# EAGLE design TGO (EAGLE 9.1.3)
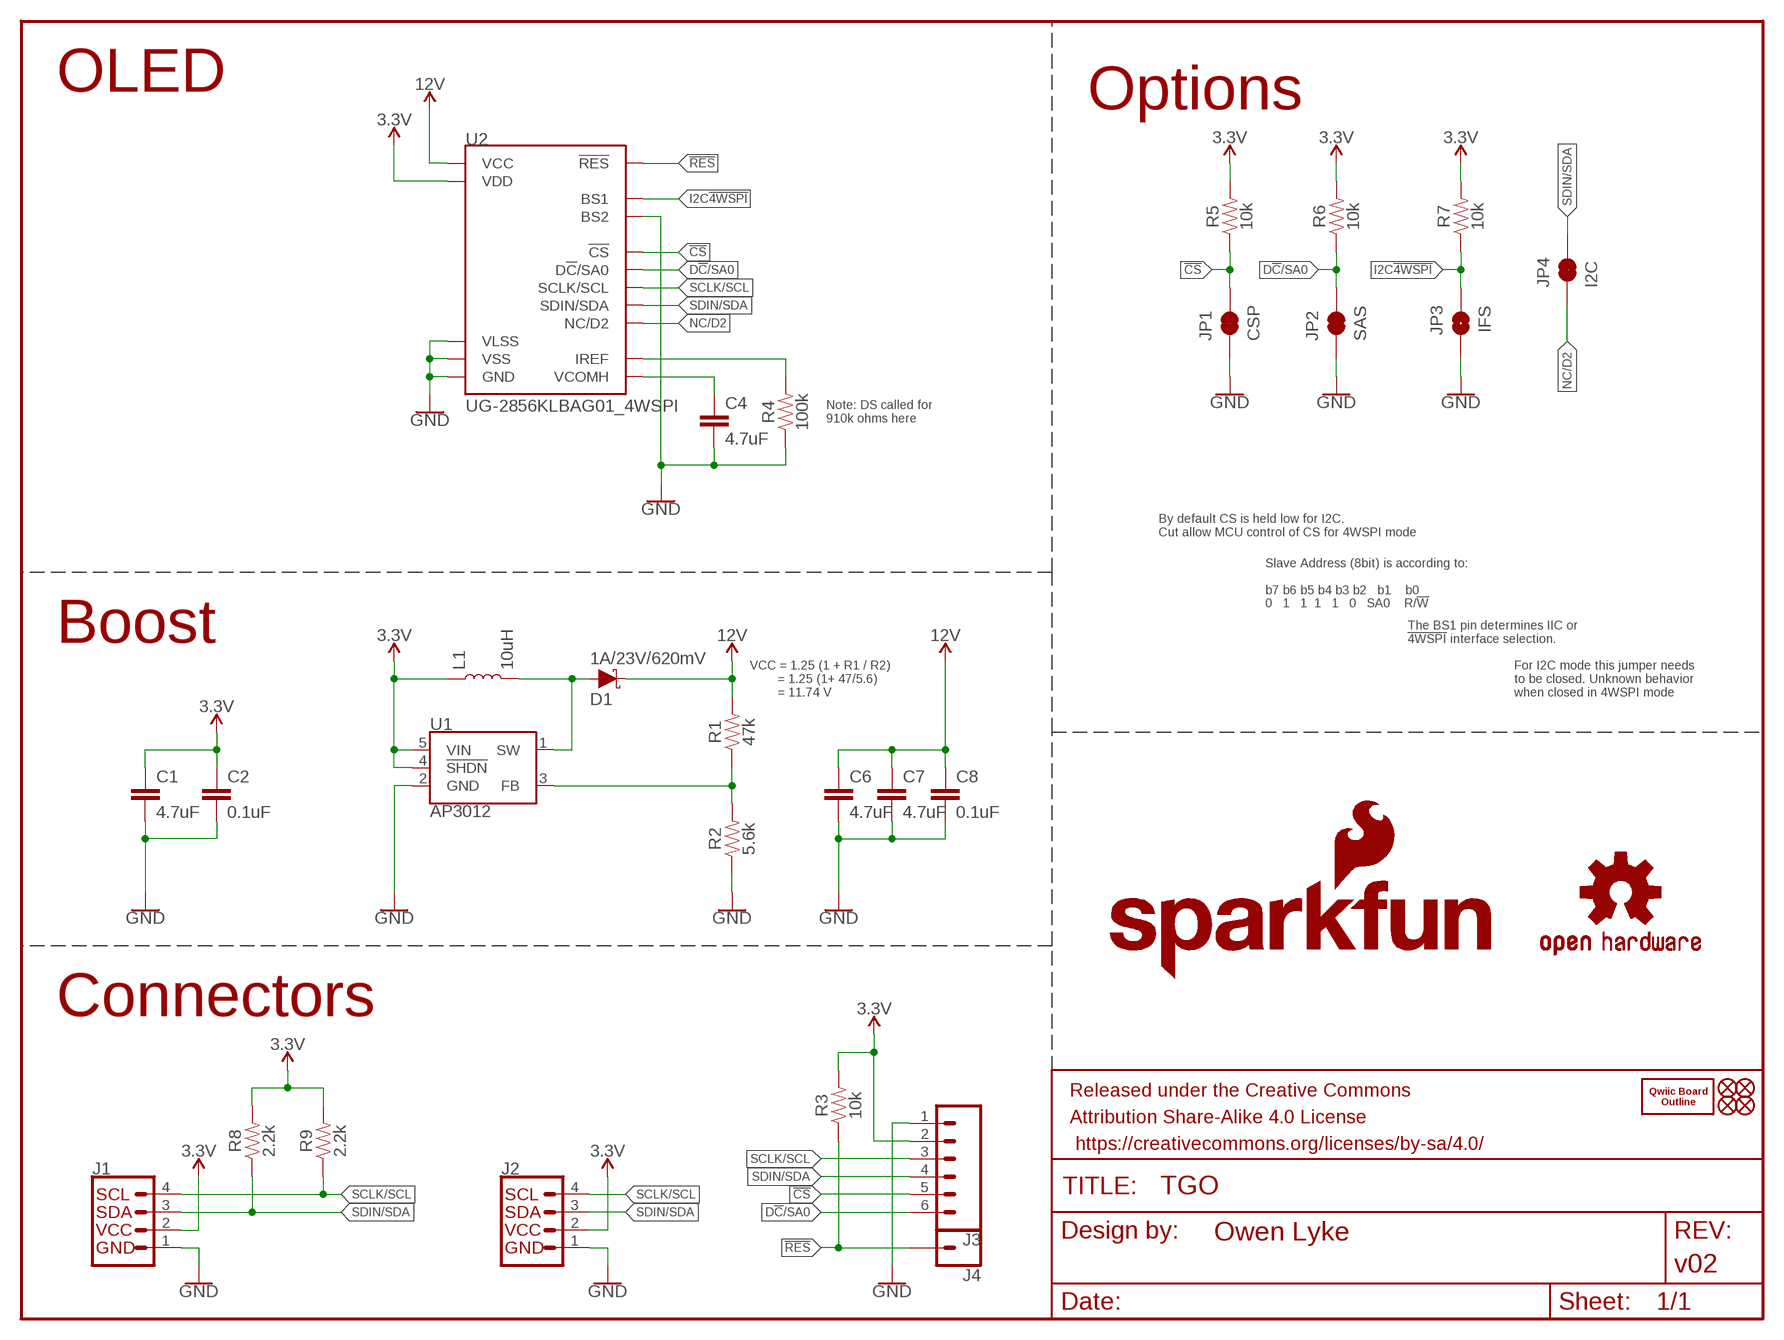
[diagram p0: schematic, sheet 1]

## Parts
C1  4.7uF  4.7UF-0603-35V-(20%)  [0603]
C2  0.1uF  0.1UF-0603-100V-10%  [0603]
C4  4.7uF  4.7UF-0603-35V-(20%)  [0603]
C6  4.7uF  4.7UF-0603-35V-(20%)  [0603]
C7  4.7uF  4.7UF-0603-35V-(20%)  [0603]
C8  0.1uF  0.1UF-0603-100V-10%  [0603]
D1  1A/23V/620mV  DIODE-SCHOTTKY-BAT20J  [SOD-323]
FD1  FIDUCIAL1X2  [FIDUCIAL-1X2]
FD2  FIDUCIAL1X2  [FIDUCIAL-1X2]
FD3  FIDUCIAL1X2  [FIDUCIAL-1X2]
FD4  FIDUCIAL1X2  [FIDUCIAL-1X2]
FRAME1  FRAME-LETTER  [CREATIVE_COMMONS]
J1  QWIIC_CONNECTORJS-1MM  [1X04_1MM_RA]
J2  QWIIC_CONNECTORJS-1MM  [1X04_1MM_RA]
J3  CONN_06NO_SILK_NO_POP  [1X06_NO_SILK]
J4  CONN_01PTH_NO_SILK_YES_STOP  [1X01_NO_SILK]
JP1  CSP  JUMPER-SMT_2_NC_TRACE_SILK  [SMT-JUMPER_2_NC_TRACE_SILK]
JP2  SAS  JUMPER-SMT_2_NC_TRACE_SILK  [SMT-JUMPER_2_NC_TRACE_SILK]
JP3  IFS  JUMPER-SMT_2_NO_SILK  [SMT-JUMPER_2_NO_SILK]
JP4  I2C  JUMPER-SMT_2_NC_TRACE_SILK  [SMT-JUMPER_2_NC_TRACE_SILK]
L1  10uH  INDUCTOR-CDRH-10UH  [INDUCTOR_4.7UH]
LOGO1  SFE_LOGO_NAME_FLAME.1_INCH  [SFE_LOGO_NAME_FLAME_.1]
LOGO2  OSHW-LOGOS  [OSHW-LOGO-S]
R1  47k  47KOHM-0603-1/10W-1%  [0603]
R2  5.6k  5.6KOHM-0603-1/10W-1%  [0603]
R3  10k  10KOHM-0603-1/10W-1%  [0603]
R4  100k  100KOHM-0603-1/10W-1%  [0603]
R5  10k  10KOHM-0603-1/10W-1%  [0603]
R6  10k  10KOHM-0603-1/10W-1%  [0603]
R7  10k  10KOHM-0603-1/10W-1%  [0603]
R8  2.2k  2.2KOHM-0603-1/10W-1%  [0603]
R9  2.2k  2.2KOHM-0603-1/10W-1%  [0603]
U1  AP3012  [SOT23-5]
U2  UG-2856KLBAG01_4WSPI  [FPC05024-42201]
U$1  QWIIC_BOARD_OUTLINEH  [QWIIC_BOARD_MOUNT_HOLES]

## Nets
3.3V: C1.1 C2.1 J1.2 J2.2 J3.2 L1.P$1 R3.2 R5.2 R6.2 R7.2 R8.2 R9.2 U1.4(!SHDN!) U1.5(VIN) U2.P$5(VDD)
12V: C6.1 C7.1 C8.1 D1.C R1.2 U2.P$23(VCC)
!CS: J3.5 JP1.2 R5.1 U2.P$8(!CS)
!RES: J4.1 R3.1 U2.P$9(!RES)
D!C!/SA0: J3.6 JP2.2 R6.1 U2.P$10(D!C!/SA0)
GND: C1.2 C2.2 C4.2 C6.2 C7.2 C8.2 J1.1 J2.1 J3.1 JP1.1 JP2.1 JP3.2 R2.1 R4.1 U1.2(GND) U2.P$1(GND) U2.P$2(VLSS) U2.P$3(VSS) U2.P$7(BS2) U2.P$11(GND) U2.P$12(GND) U2.P$16(GND) U2.P$17(GND) U2.P$18(GND) U2.P$19(GND) U2.P$20(GND) U2.P$24(GND)
I2C!4WSPI: JP3.1 R7.1 U2.P$6(BS1)
N$1: R4.2 U2.P$21(IREF)
N$3: C4.1 U2.P$22(VCOMH)
N$4: D1.A L1.P$2 U1.1(SW)
N$5: R1.1 R2.2 U1.3(FB)
NC/D2: JP4.1 U2.P$15(NC/D2)
SCLK/SCL: J1.4 J2.4 J3.3 R9.1 U2.P$13(SCLK/SCL)
SDIN/SDA: J1.3 J2.3 J3.4 JP4.2 R8.1 U2.P$14(SDIN/SDA)

## Notes on the sheet
- OLED | Options
- Note: DS called for
  910k ohms here
- By default CS is held low for I2C. 
  Cut allow MCU control of CS for 4WSPI mode
- Slave Address (8bit) is according to:
  
  b7 b6 b5 b4 b3 b2   b1    b0
  0   1   1  1   1   0   SA0    R/!W
- Boost
- The BS1 pin determines IIC or 
  !4WSPI! interface selection.
- VCC = 1.25 (1 + R1 / R2)
          = 1.25 (1+ 47/5.6)
          = 11.74 V
- For I2C mode this jumper needs 
  to be closed. Unknown behavior 
  when closed in 4WSPI mode
- Connectors

## Library data of the parts
C1 C4 C6 C7 = SparkFun-Capacitors:4.7UF: 4.7µF ceramic capacitors A capacitor is a passive two-terminal electrical component used to store electrical energy temporarily in an electric field.; PROD_ID: CAP-14106
C2 C8 = SparkFun-Capacitors:0.1UF: 0.1µF ceramic capacitors A capacitor is a passive two-terminal electrical component used to store electrical energy temporarily in an electric field.; PROD_ID: CAP-08390
D1 = SparkFun-DiscreteSemi:DIODE-SCHOTTKY: Schottky diode A Schottky diode is a semiconductor diode which has a low forward voltage drop and a very fast switching action.; PROD_ID: DIO-11623
FD1-FD4 = SparkFun-Aesthetics:FIDUCIAL: Fiducial Alignment Points Point-of-reference for pick-and-place machines and other optical instruments.
FRAME1 = SparkFun-Aesthetics:FRAME-LETTER: Schematic Frame - Letter Standard 8.5x11 US Letter frame; DESIGNER: Owen Lyke; REV: v02
J1 J2 = SparkFun-Connectors:QWIIC_CONNECTOR: SparkFun I2C Standard Qwiic Connector An SMD 1mm pitch JST connector makes it easy and quick (get it? Qwiic?) to connect I2C devices to each other. The Qwiic system <http://www.sparkfun.com/qwiic> enables fast and solderless connection between popular platforms and various sensors and actuators. We carry 200mm <https://www.sparkfun.com/products/14204>, 100mm <https://www.sparkfun.com/products/14205>, 50mm <https://www.sparkfun.com/products/14206>, and breadboard friendly <https://www.sparkfun.com/products/14207> Qwiic cables. We also offer 10 pcs strips <https://www.sparkfun.com/products/14323> the SMD connectors.; PROD_ID: CONN-13694
J3 = SparkFun-Connectors:CONN_06: Multi connection point. Often used as Generic Header-pin footprint for 0.1 inch spaced/style header connections On any of the 0.1 inch spaced packages, you can populate with these: Break Away Headers - Straight <https://www.sparkfun.com/products/116> (PRT-00116) Break Away Male Headers - Right Angle <https://www.sparkfun.com/products/553> (PRT-00553) Female Headers <https://www.sparkfun.com/products/115> (PRT-00115) Break Away Headers - Machine Pin <https://www.sparkfun.com/products/117> (PRT-00117) Break Away Female Headers - Swiss Machine Pin <https://www.sparkfun.com/products/743> (PRT-00743) Arduino Stackable Header - 6 Pin <https://www.sparkfun.com/products/9280> (PRT-09280) For SCREWTERMINALS and SPRING TERMINALS visit here: Screw Terimnals on SparkFun.com <https://www.sparkfun.com/search/results?term=Screw+Terminals> (5mm/3.5mm/2.54mm spacing) This device is also useful as a general connection point to wire up your design to another part of your project. Our various solder wires solder well into these plated through hole pads. Hook-Up Wire - Assortment (Stranded, 22 AWG) <https://www.sparkfun.com/products/11375> (PRT-11375) Hook-Up Wire - Assortment (Solid Core, 22 AWG) <https://www.sparkfun.com/products/11367> (PRT-11367) View the entire wire category on our website here <https://www.sparkfun.com/categories/141>
J4 = SparkFun-Connectors:CONN_01: Single connection point. Often used as Generic Header-pin footprint for 0.1 inch spaced/style header connections On any of the 0.1 inch spaced packages, you can populate with these: Break Away Headers - Straight <https://www.sparkfun.com/products/116> (PRT-00116) Break Away Male Headers - Right Angle <https://www.sparkfun.com/products/553> (PRT-00553) Female Headers <https://www.sparkfun.com/products/115> (PRT-00115) Break Away Headers - Machine Pin <https://www.sparkfun.com/products/117> (PRT-00117) Break Away Female Headers - Swiss Machine Pin <https://www.sparkfun.com/products/743> (PRT-00743) This device is also useful as a general connection point to wire up your design to another part of your project. Our various solder wires solder well into these plated through hole pads. Hook-Up Wire - Assortment (Stranded, 22 AWG) <https://www.sparkfun.com/products/11375> (PRT-11375) Hook-Up Wire - Assortment (Solid Core, 22 AWG) <https://www.sparkfun.com/products/11367> (PRT-11367) View the entire wire category on our website here <https://www.sparkfun.com/categories/141> Special notes: SMTSO-256-ET is a "flush mount" nut for a 4-40 screw. We mostly use this on specialty testbeds; it is a nice way to connect hardware to your PCB at an adjustable hieght. Also note, the SNAP packages are for using a snappable style connector. We sell a baggie of snaps and they are also used on two LilyPad designs: Snap Assortment - 30 pack (male and female) <https://www.sparkfun.com/products/11347> (DEV-11347) LilyPad Arduino SimpleSnap <https://www.sparkfun.com/products/10941> (DEV-10941) LilyPad SimpleSnap Protoboard <https://www.sparkfun.com/products/10940> (DEV-10940)
JP1 JP2 JP4 = SparkFun-Jumpers:JUMPER-SMT_2_NC_TRACE: Normally closed trace jumper This jumper has a trace between two pads so it's normally closed (NC). Use a razor knife to open the connection. For best results follow the IPC guidelines for cutting traces: Cutout at least 0.063 mm (0.005 in). Remove all loose material to clean up the cut area. Seal the cut with an approved epoxy. Reapply solder to reclose the connection.
JP3 = SparkFun-Jumpers:JUMPER-SMT_2_NO: Normally open jumper This jumper has two pads in close proximity to each other. Apply solder to close the connection. Round pads are easier to solder for beginners, but are a lot larger. SparkFun Product that uses the round pads: SparkFun EL Sequencer <https://www.sparkfun.com/products/12781>
L1 = SparkFun-Coils:INDUCTOR: Inductors Resist changes in electrical current. Basically a coil of wire. SparkFun Products: SparkFun Load Cell Amplifier - HX711 <https://www.sparkfun.com/products/13879> IOIO-OTG - V2.2 <https://www.sparkfun.com/products/13613>; PROD_ID: NDUC-13968
LOGO1 = SparkFun-Aesthetics:SFE_LOGO_NAME_FLAME: SparkFun Font Logo w/ Flame This is the SparkFun full logo. The logo on the schematic will always be the same size; the package variant is the height of the flame part of the logo. Default layer for the logo on the board is tSilk.
LOGO2 = SparkFun-Aesthetics:OSHW-LOGO: Open-Source Hardware (OSHW) Logo This logo indicates the piece of hardware it is found on incorporates a OSHW license and/or adheres to the definition of open source hardware found here: http://freedomdefined.org/OSHW
R1 = SparkFun-Resistors:47KOHM: 47kΩ resistor A resistor is a passive two-terminal electrical component that implements electrical resistance as a circuit element. Resistors act to reduce current flow, and, at the same time, act to lower voltage levels within circuits. - Wikipedia; PROD_ID: RES-07871
R2 = SparkFun-Resistors:5.6KOHM: 5.6kΩ resistor A resistor is a passive two-terminal electrical component that implements electrical resistance as a circuit element. Resistors act to reduce current flow, and, at the same time, act to lower voltage levels within circuits. - Wikipedia; PROD_ID: RES-12378
R3 R5-R7 = SparkFun-Resistors:10KOHM: 10kΩ resistor A resistor is a passive two-terminal electrical component that implements electrical resistance as a circuit element. Resistors act to reduce current flow, and, at the same time, act to lower voltage levels within circuits. - Wikipedia; PROD_ID: RES-00824
R4 = SparkFun-Resistors:100KOHM: 100kΩ resistor A resistor is a passive two-terminal electrical component that implements electrical resistance as a circuit element. Resistors act to reduce current flow, and, at the same time, act to lower voltage levels within circuits. - Wikipedia; PROD_ID: RES-07828
R8 R9 = SparkFun-Resistors:2.2KOHM: 2.2kΩ resistor A resistor is a passive two-terminal electrical component that implements electrical resistance as a circuit element. Resistors act to reduce current flow, and, at the same time, act to lower voltage levels within circuits. - Wikipedia; PROD_ID: RES-08272
U1 = SparkFun-IC-Power:AP3012: AP3012 The AP3012 is a high power, constant frequency, current mode PWM, inductor based, step-up (boost) converter. The converter operates at high frequency (1.5MHz) so that a small, low profile inductor can be used. Datasheet <https://www.diodes.com/assets/Datasheets/AP3012.pdf>; PROD_ID: VREG-13911
U2 = SparkFun-Displays:UG-2856KLBAG01_4WSPI; PROD_ID: CONN-14195
U$1 = SparkX:QWIIC_BOARD_OUTLINE: Standard Outline of a Qwiic Board. Good for defining a spot on shields and board areas in which to mount a Qwiic Board.

## Board
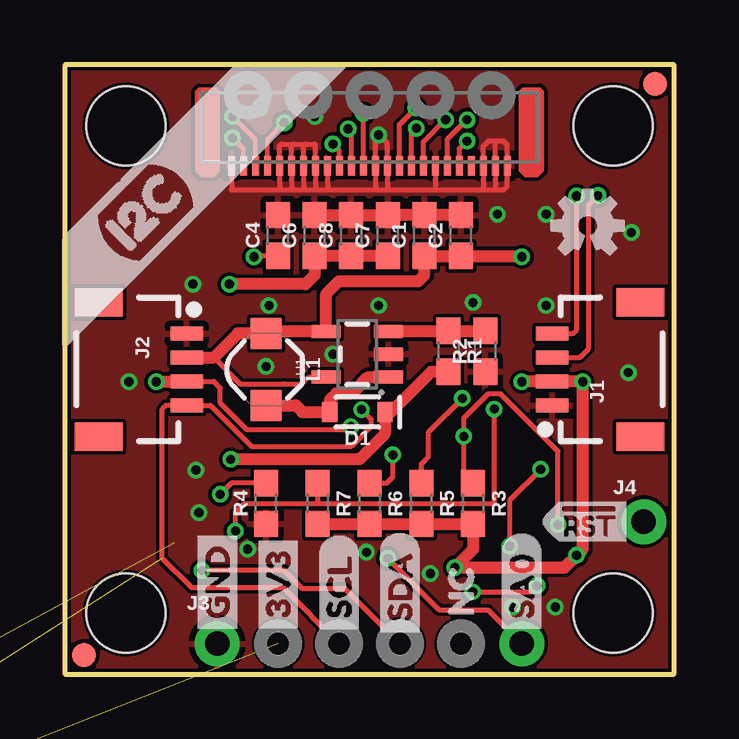
[diagram p1: board, top side]
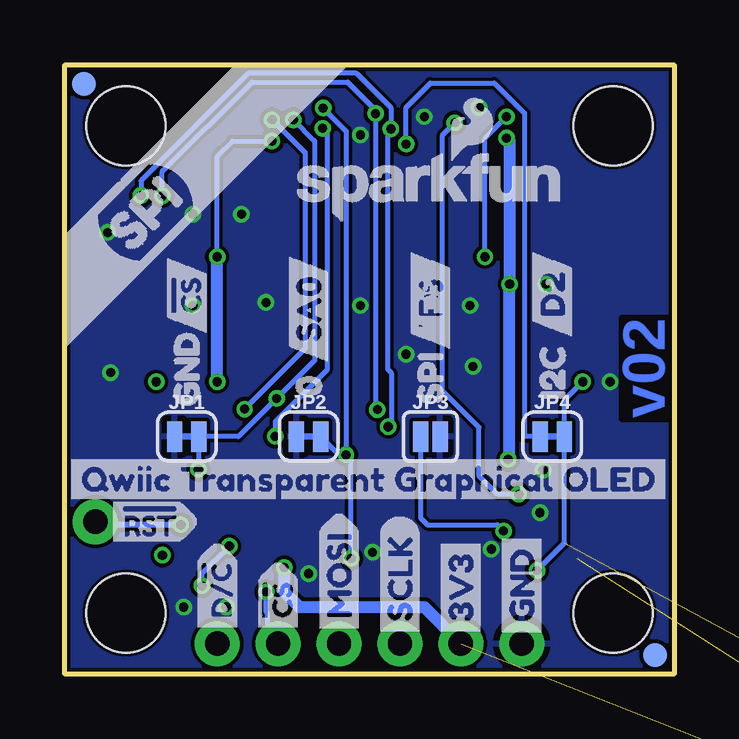
[diagram p2: board, bottom side, seen from below]

Size 25.4 x 25.4 mm. Coordinates in mm from the lower left corner, seen from the top.
Outline: 0,0 25.4,0 25.4,25.4 0,25.4 0,0
Copper layers (1*16): Top 0.035mm / dielectric 1.5mm / Bottom 0.035mm
Design rules "SparkFun-2-layer-PCBWay-LIMIT": minimum track width 6mil, minimum drill 0.3mm, track to track 6mil, track to pad 6mil, pad to pad 6mil, via to via 6mil, smd to smd 6mil, copper to edge 6mil, drill to drill 6mil, minimum pad ring 6mil, minimum via ring 6mil, stop-mask expansion 4mil, vias tented up to drill 25mil, thermal gap 10mil

### Footprints (pad centres in the part's own frame; a part is rotated, then mirrored left to right if it is on the bottom)
0603 = smd 1.1 x 1: 1 -0.85,0; 2 0.85,0
SOD-323 = smd 0.63 x 0.83: A 1.15,0; C -1.15,0
FIDUCIAL-1X2 = smd 1 x 1: 1 0,0
1X04_1MM_RA = smd 0.6 x 1.35: 1 -1.5,0; 2 -0.5,0; 3 0.5,0; 4 1.5,0 | smd 1.2 x 2: NC1 2.8,-3.675; NC2 -2.8,-3.675
1X06_NO_SILK = drill 1.016 pad 1.88: 1 0,0; 2 2.54,0; 3 5.08,0; 4 7.62,0; 5 10.16,0; 6 12.7,0
1X01_NO_SILK = drill 1.016 pad 1.88: 1 0,0
SMT-JUMPER_2_NC_TRACE_SILK = smd 0.635 x 1.27: 1 -0.508,0; 2 0.508,0
SMT-JUMPER_2_NO_SILK = smd 0.635 x 1.27: 1 -0.406,0; 2 0.406,0
INDUCTOR_4.7UH = smd 1.3 x 1.3: P$1 -1.5,0; P$2 1.5,0
SOT23-5 = smd 0.55 x 1.2: 1 -0.95,-1.3; 2 0,-1.3; 3 0.95,-1.3; 4 0.95,1.3; 5 -0.95,1.3
FPC05024-42201 = smd 0.3 x 0.8: P$1 -5.75,0.4; P$2 -5.25,0.4; P$3 -4.75,0.4; P$4 -4.25,0.4; P$5 -3.75,0.4; P$6 -3.25,0.4; P$7 -2.75,0.4; P$8 -2.25,0.4; P$9 -1.75,0.4; P$10 -1.25,0.4; P$11 -0.75,0.4; P$12 -0.25,0.4; P$13 0.25,0.4; P$14 0.75,0.4; P$15 1.25,0.4; P$16 1.75,0.4; P$17 2.25,0.4; P$18 2.75,0.4; P$19 3.25,0.4; P$20 3.75,0.4; P$21 4.25,0.4; P$22 4.75,0.4; P$23 5.25,0.4; P$24 5.75,0.4
QWIIC_BOARD_MOUNT_HOLES = hole 3.302: -10.16,10.16; 10.16,10.16; 10.16,-10.16; -10.16,-10.16

### Placement (x,y rotation side)
C1  14.99,18.29 90 top
C2  16.51,18.29 90 top
C4  8.89,18.29 90 top
C6  10.41,18.29 90 top
C7  13.46,18.29 90 top
C8  11.94,18.29 90 top
D1  12.19,10.92 180 top
FD1  0.79,0.79 0 top
FD2  0.79,0.79 0 bottom
FD3  24.61,24.61 0 top
FD4  24.61,24.61 0 bottom
FRAME1  -11.43,-10.16 0 top  (outside the outline)
J1  20.32,12.7 90 top
J2  5.08,12.7 270 top
J3  6.35,1.27 0 top
J4  24.13,6.35 0 top
JP1  20.32,9.91 0 bottom
JP2  15.24,9.91 0 bottom
JP3  10.16,9.91 0 bottom
JP4  5.08,9.91 0 bottom
L1  8.38,12.7 270 top
LOGO1  10.16,20.32 0 bottom
LOGO2  21.79,18.69 0 top
R1  16,13.46 270 top
R2  17.53,13.46 90 top
R3  17.02,7.11 270 top
R4  8.38,7.11 90 top
R5  14.86,7.11 270 top
R6  12.7,7.11 270 top
R7  10.54,7.11 270 top
R8  -30.48,-13.97 0 top  (outside the outline)
R9  -30.48,-17.78 0 top  (outside the outline)
U1  12.19,13.34 90 top
U2  12.7,21.59 180 top
U$1  12.7,12.7 0 top
U$2  [QWIIC_TRANSPARENT_GRAPHICAL_OLED15]  25.65,8.13 0 bottom
U$3  [D27]  5.08,13.97 90 bottom
U$4  [GND0]  6.35,1.4 90 top
U$5  [3V31]  8.89,1.4 90 top
U$6  [SCL2]  11.43,1.4 90 top
U$7  [SDA3]  13.97,1.27 90 top
U$8  [#CS7]  16.51,1.27 90 bottom
U$9  [NC10]  16.51,1.52 90 top
U$10  [MOSI9]  13.97,1.4 90 bottom
U$11  [SCLK8]  11.43,1.27 90 bottom
U$12  [SA08]  19.05,1.4 90 top
U$13  [3V31]  8.89,1.27 90 bottom
U$14  [GND0]  6.35,1.27 90 bottom
U$15  [D##C6]  19.05,1.27 90 bottom
U$16  [GND10]  20.32,10.29 90 bottom
U$17  [#RST1]  24.03,6.35 0 bottom
U$18  [013]  15.24,10.67 90 bottom
U$19  [I2C3]  1.14,17.14 45 top
U$20  [D27]  10.16,13.97 90 bottom
U$21  [SA05]  15.24,12.95 90 bottom
U$22  [I2C13]  5.08,10.54 90 bottom
U$23  [#CS4]  20.32,13.97 90 bottom
U$24  [SPI2]  24.13,17.14 45 bottom
U$26  [IFS17]  10.16,13.46 90 bottom
U$28  [#RST0]  19.68,6.35 0 top
U$29  [SPI6]  10.16,10.41 90 bottom

### Tracks (layer width: path | path; a pad name or v marks a point on that pad's centre or on a via)
3.3V  (via drill 0.38)  (2 unrouted)
  Top 0.203: U2.P$5 16.45,21.91 v16.76,22.23 | U1.5 10.16,12.38 9.88,12.1 9.14,12.1 7.31,12.1 6.21,13.2
  Top 0.508: J2.2 6.21,13.2 7.21,14.2 L1.P$1 8.47,14.29 U1.4 10.89,15.85 11.43,16.38 14.73,16.38 14.99,16.64 C1.1 C2.1 19.01,17.44 v19.05,17.4 | v19.05,12.19 v19.06,12.2 J1.2 v21.58,12.2 v21.59,12.19 21.59,5.21 v21.34,4.95 20.83,4.45 v16.26,4.45 17.02,5.21 R3.2 R5.2 R6.2 R7.2
  Bottom 0.203: v19.05,17.4 19.05,21.59 18.41,22.23 v16.76,22.23
  Bottom 0.508: v19.05,12.19 v19.05,17.4 | v16.26,4.45 16.26,3.43 15.62,2.79 10.41,2.79 J3.2
12V  (via drill 0.38)
  Top 0.203: U2.P$23 7.45,21.89 v6.99,22.35
  Top 0.508: C7.1 C8.1 C6.1 10.41,16.64 10.03,16.26 v6.86,16.26 | R1.2 15.28,12.61 13.59,10.92 D1.C 13.34,10.02 12.27,8.95 v6.92,8.95
  Bottom 0.508: v6.99,22.35 6.86,22.23 v6.86,16.26 6.86,9.01 v6.92,8.95
!CS  (via drill 0.38)
  Top 0.203: U2.P$8 14.95,22.19 v15.88,23.11 | R5.1 14.86,8.76 15.05,8.95 15.15,9.05 15.15,10.07 v16.57,11.49 | v17,3.43 19.43,3.43 v19.68,3.68 | v19.84,8.53 18.54,7.24 v18.54,5.33
  Bottom 0.203: v15.88,23.11 14.99,22.23 14.99,13.08 v16.57,11.49 18.16,9.91 JP1.2 19.81,8.56 v19.84,8.53 | J3.5 16.95,1.71 16.95,2.54 17,2.59 v17,3.43 | v19.68,3.68 19.68,4.19 v18.54,5.33
!RES  (via drill 0.38)
  Top 0.203: U2.P$9 14.45,22.55 v14.66,22.76 | R3.1 16.63,8.35 v16.63,9.91 16.63,10.67 17.64,11.68 18.16,11.68 20.56,9.28 v20.56,6.22
  Bottom 0.203: v14.66,22.76 14.48,22.58 14.48,12.68 16.63,10.52 v16.63,9.91
  Bottom 0.254: v20.56,6.22 24,6.22 J4.1
D!C!/SA0  (via drill 0.38)
  Top 0.203: U2.P$10 13.95,22.92 v14.63,23.6 | J3.6 17.65,2.67 15.62,2.67 v13.46,4.83 | R6.1 13.42,7.96 13.68,8.22 v13.68,9.14
  Bottom 0.203: v14.63,23.6 13.68,22.64 v13.68,9.14 | v13.68,9.14 13.97,9.14 JP2.2 | v13.46,4.83 13.46,8.93 v13.68,9.14
GND  (via drill 0.38)
  Top 0.203: U2.P$24 6.95,20.19 8.89,20.19 | 8.89,20.19 9.53,20.19 | 9.53,20.19 9.91,20.19 | 9.91,20.19 10.41,20.19 | 10.41,20.19 10.92,20.19 | 10.92,20.19 12.95,20.19 | 12.95,20.19 13.46,20.19 | 13.46,20.19 15.49,20.19 | 15.49,20.19 17.53,20.19 | 17.53,20.19 17.91,20.19 | 17.91,20.19 18.29,20.19 18.45,20.36 U2.P$1 18.45,22.06 18.29,22.23 17.91,22.23 | 17.91,20.19 17.95,20.24 U2.P$2 17.95,22.18 17.91,22.23 | 17.53,20.19 17.45,20.27 U2.P$3 17.45,22.02 17.65,22.23 17.91,22.23 | U2.P$7 15.45,20.24 15.49,20.19 | 13.46,20.19 13.45,20.2 U2.P$11 13.45,22.11 v13.08,22.48 12.95,22.35 U2.P$12 12.95,20.2 12.95,20.19 | U2.P$16 10.95,20.22 10.92,20.19 | 10.41,20.19 10.45,20.23 U2.P$17 10.45,22.06 10.41,22.1 10.03,22.1 | 9.91,20.19 9.95,20.24 U2.P$18 9.95,22.02 10.03,22.1 | 9.53,20.19 9.45,20.27 U2.P$19 9.45,22.02 9.53,22.1 | 8.89,20.19 8.95,20.25 U2.P$20 8.95,22.03 9.02,22.1 9.53,22.1 | 9.53,22.1 10.03,22.1
  Top 0.508: C6.2 C8.2 C7.2 C1.2 C2.2
  other vias: 11.18,13.34 15.24,4.19 8.38,12.83 8.51,15.37 7.62,5.21 5.46,8.51 18.67,2.79 2.67,12.19 5.33,16.26 20.45,2.79 18.03,19.18 20.07,19.18 20.07,15.37 17.02,15.49 10.41,23.24 8.13,23.62 23.62,18.41 23.5,12.57 13.08,15.37 5.59,6.73 12.57,5.08
  pour Top (isolate 0.051): 0,25.4 25.4,25.4 25.4,0 0,0
  pour Bottom (isolate 0.051): 0,25.4 25.4,25.4 25.4,0 0,0
I2C!4WSPI  (via drill 0.38)
  Top 0.203: U2.P$6 15.95,22.3 v16.76,23.11 | R7.1 10.54,7.11 | v7.11,5.97 7.11,6.73 7.49,7.11 10.54,7.11 | v17.91,11.05 17.91,7.11 10.54,7.11
  Bottom 0.203: v16.76,23.11 15.37,21.72 15.37,13.59 v17.91,11.05 | JP3.1 10.57,6.5 10.29,6.22 7.37,6.22 v7.11,5.97
N$1  (via drill 0.38)
  Top 0.203: U2.P$21 8.45,22.29 v9.14,22.99 | R4.2 6.95,7.96 v6.48,7.49
  Bottom 0.203: v9.14,22.99 9.65,22.48 9.65,11.81 8.13,10.29 8.13,8.26 7.37,7.49 v6.48,7.49
N$3  (via drill 0.38)
  Top 0.203: U2.P$22 7.95,22.28 v6.99,23.24 | C4.1 7.93,17.44 v7.89,17.4
  Bottom 0.203: v7.89,17.4 7.89,22.34 v6.99,23.24
N$4
  Top 0.508: U1.1 12.64,12.38 12.13,11.87 11.96,11.7 11.32,11.7 11.04,11.42 D1.A 9.91,10.92 9.63,11.2 L1.P$2
N$5
  Top 0.508: R2.2 R1.1 15.97,14.29 U1.3
NC/D2  (via drill 0.38)
  Top 0.203: U2.P$15 11.45,21.82 v11.18,22.1
  Bottom 0.203: JP4.1 6.22,9.91 6.22,23.37 7.49,24.64 10.16,24.64 11.18,23.62 v11.18,22.1
SCLK/SCL  (via drill 0.38)  (1 unrouted)
  Top 0.203: U2.P$13 v12.45,23.36 v12.45,23.37 | J1.4 21.18,14.2 21.34,14.35 v21.34,19.94 | J3.3 9.09,3.61 5.28,3.61 4.06,4.83 4.06,11.05 4.21,11.2 J2.4 6.07,11.2 7.78,9.49 11.94,9.49 12.77,10.32 12.77,10.62 v12.37,11.03
  Bottom 0.203: v12.37,11.03 12.45,11.11 v12.45,23.37 12.45,23.52 13.61,24.69 17.6,24.69 21.34,20.95 v21.34,19.94
SDIN/SDA  (via drill 0.38)  (1 unrouted)
  Top 0.203: U2.P$14 11.95,22.59 v11.81,22.73 | J3.4 11.68,3.56 9.91,3.56 9.14,4.32 v5.71,4.32 | J2.3 6.21,12.2 6.48,11.94 6.48,11.3 7.59,10.19 11.79,10.19 v11.92,10.31 | J1.3 21.46,13.2 21.84,13.58 21.84,19.57 v22.23,19.95
  Top 0.508: v3.81,12.19 v3.82,12.2 J2.3
  Bottom 0.203: v3.81,12.19 4.57,11.43 JP4.2 4.57,5.46 v5.71,4.32 | v22.23,19.95 22.23,20.57 17.75,25.04 13.23,25.04 11.81,23.62 v11.81,22.73 11.94,22.61 11.94,12.7 11.77,12.53 11.77,10.46 v11.92,10.31

### Text on the board
Bottom: v02
tDocu: Owen Lyke